# EAGLE design front (EAGLE 6.1)
DOC: PVR-SCH-001; PART_NO: PC-01; PROJECT: PVR; REV: A; TITLE: Front panel interface
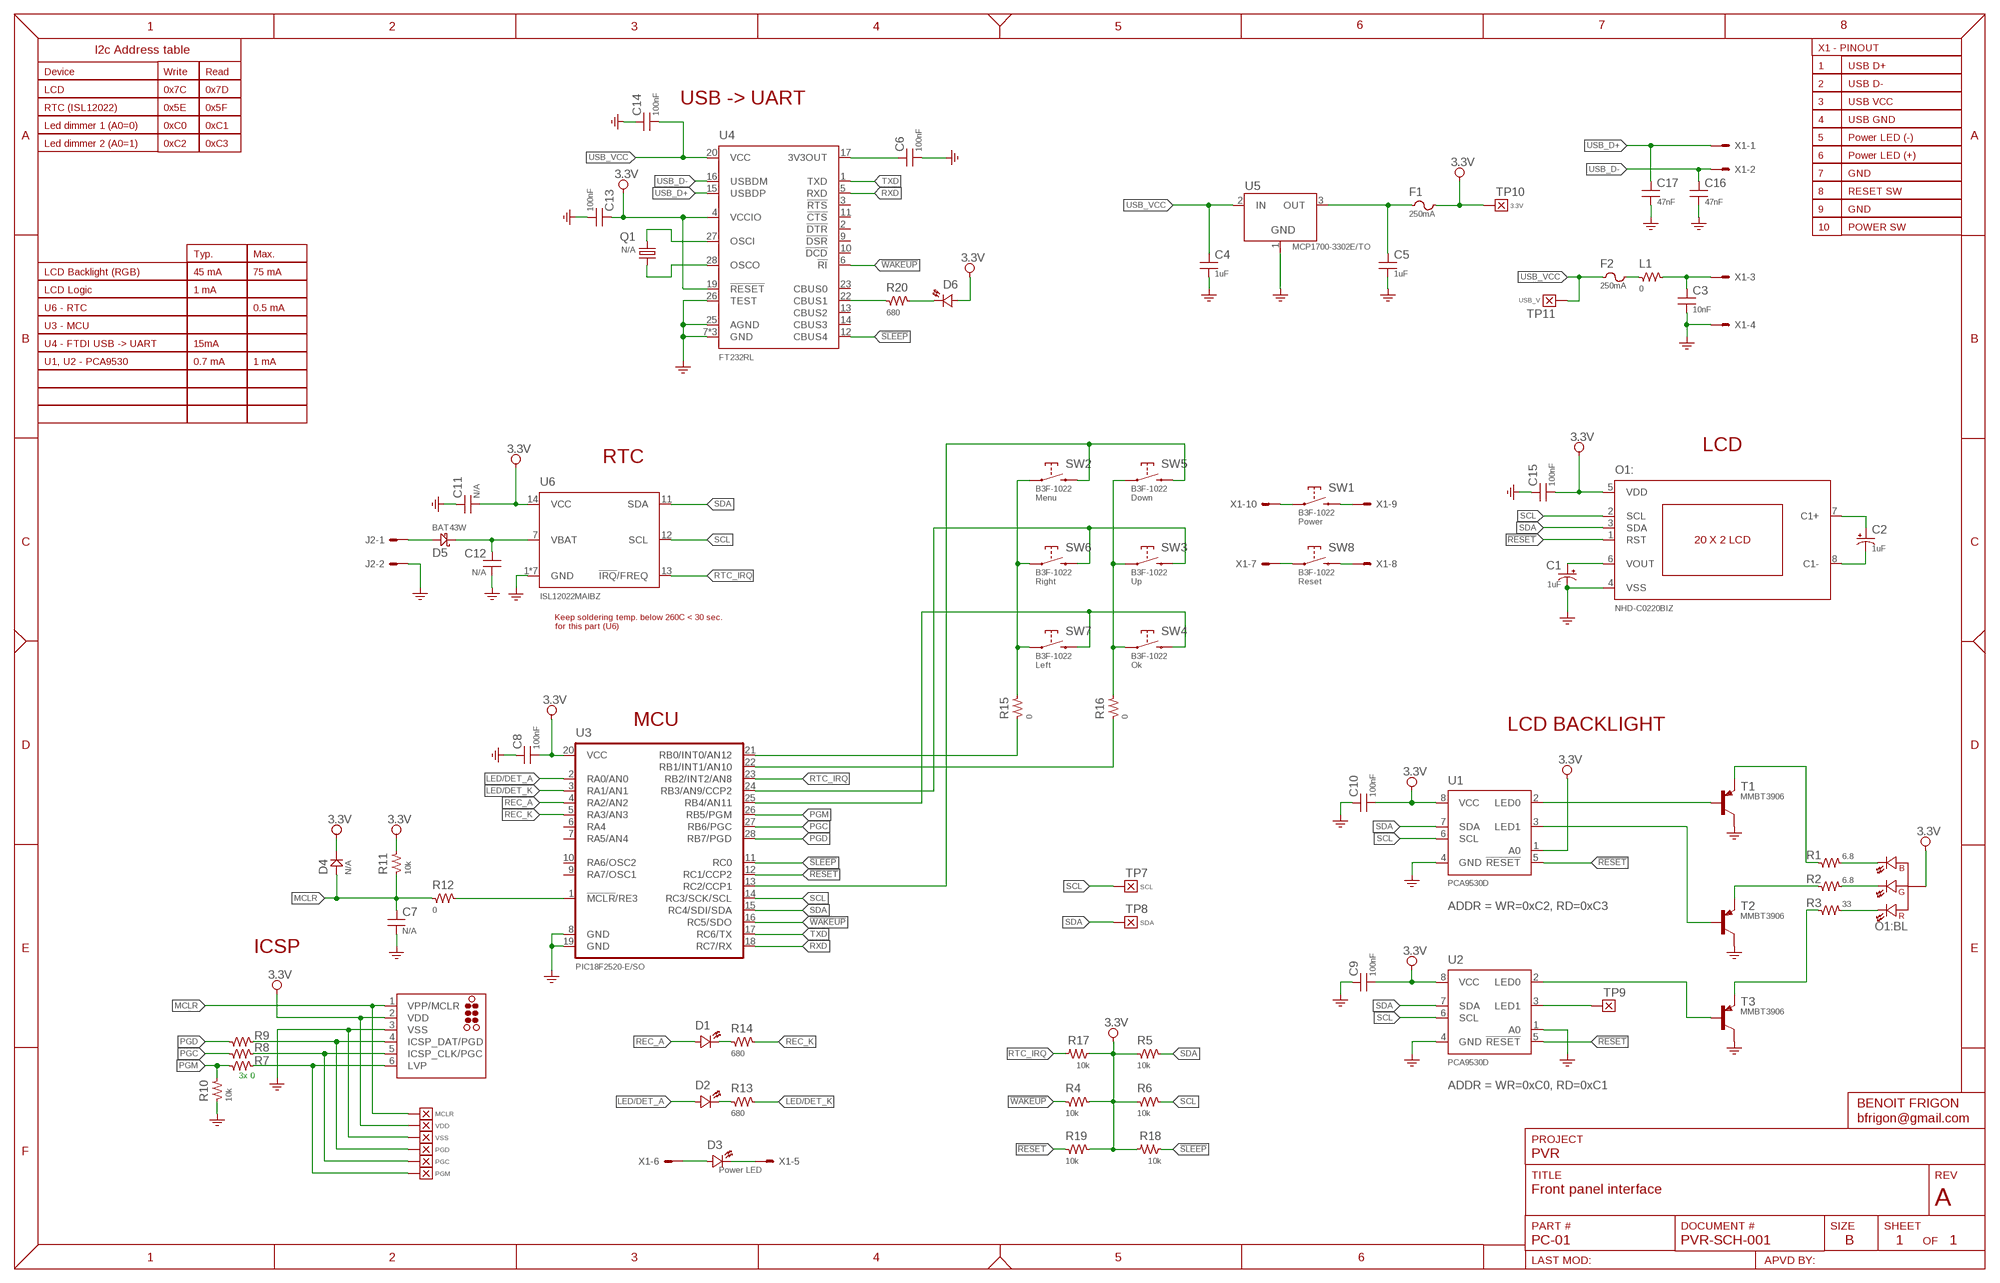
[diagram p0: schematic, sheet 1]

## Parts
C1  1uF  CAP-E-S0805  [CAP_S0805]
C2  1uF  CAP-E-S0805  [CAP_S0805]
C3  10nF  CAP-0805  [SMD_0805]
C4  1uF  CAP-0805  [SMD_0805]
C5  1uF  CAP-0805  [SMD_0805]
C6  100nF  CAP-0603  [SMD_0603]
C7  N/A  CAP-0603  [SMD_0603]
C8  100nF  CAP-0603  [SMD_0603]
C9  100nF  CAP-0603  [SMD_0603]
C10  100nF  CAP-0603  [SMD_0603]
C11  N/A  CAP-0603  [SMD_0603]
C12  N/A  CAP-0805  [SMD_0805]
C13  100nF  CAP-0603  [SMD_0603]
C14  100nF  CAP-0603  [SMD_0603]
C15  100nF  CAP-0603  [SMD_0603]
C16  47nF  CAP-0603  [SMD_0603]
C17  47nF  CAP-0603  [SMD_0603]
D1  {ATTR:COLOR}  LED-2X5  [LED_2X5]
D2  {ATTR:COLOR}  LED-2X5  [LED_2X5]
D3  {ATTR:COLOR}  LED-2X5  [LED_2X5]
D4  N/A  DIODE-0603  [DIODE_0603]
D5  BAT43W  DIODE_SCHOTTKY-SOD323  [SOD-323]
D6  LED-0805  [CHIPLED_0805]
F1  250mA  FUSE1206  [SMD_1206]
F2  250mA  FUSE1206  [SMD_1206]
J1  TC2030-MCP  [TC2030-MCP]
J2  SNG-2MM-HEADER-02-V  [DF3X-2P-2DSA]
L1  0  RES-0805  [SMD_0805]
O1  NHD-C0220BIZ  [NHD-CO220BIZ]
Q1  N/A  XTALMM20SS  [MM20SS]
R1  6.8  RES-1206  [SMD_1206]
R2  6.8  RES-1206  [SMD_1206]
R3  33  RES-1206  [SMD_1206]
R4  10k  RES-0805  [SMD_0805]
R5  10k  RES-0805  [SMD_0805]
R6  10k  RES-0805  [SMD_0805]
R7  0  RES-0603  [SMD_0603]
R8  0  RES-0603  [SMD_0603]
R9  0  RES-0603  [SMD_0603]
R10  10k  RES-0603  [SMD_0603]
R11  10k  RES-0603  [SMD_0603]
R12  0  RES-0603  [SMD_0603]
R13  680  RES-0805  [SMD_0805]
R14  680  RES-0805  [SMD_0805]
R15  0  RES-0805  [SMD_0805]
R16  0  RES-0805  [SMD_0805]
R17  10k  RES-0603  [SMD_0603]
R18  10k  RES-0805  [SMD_0805]
R19  10k  RES-0805  [SMD_0805]
R20  680  RES-0805  [SMD_0805]
SW1  B3F-1022  [B3F-10XX]
SW2  B3F-1022  [B3F-10XX]
SW3  B3F-1022  [B3F-10XX]
SW4  B3F-1022  [B3F-10XX]
SW5  B3F-1022  [B3F-10XX]
SW6  B3F-1022  [B3F-10XX]
SW7  B3F-1022  [B3F-10XX]
SW8  B3F-1022  [B3F-10XX]
T1  MMBT3906  -PNP-SOT23-BEC  [SOT23-BEC]
T2  MMBT3906  -PNP-SOT23-BEC  [SOT23-BEC]
T3  MMBT3906  -PNP-SOT23-BEC  [SOT23-BEC]
TP1  MCLR  TEST_POINT-050  [TP_050]
TP2  VDD  TEST_POINT-050  [TP_050]
TP3  VSS  TEST_POINT-050  [TP_050]
TP4  PGD  TEST_POINT-050  [TP_050]
TP5  PGC  TEST_POINT-050  [TP_050]
TP6  PGM  TEST_POINT-050  [TP_050]
TP7  SCL  TEST_POINT-050  [TP_050]
TP8  SDA  TEST_POINT-050  [TP_050]
TP9  TEST_POINT-050  [TP_050]
TP10  3.3V  TEST_POINT-050  [TP_050]
TP11  USB_V  TEST_POINT-050  [TP_050]
U1  PCA9530D  [SOIC8]
U2  PCA9530D  [SOIC8]
U3  PIC18F2520-E/SO  [SOIC28]
U4  FT232RL  [SSOP28]
U5  MCP1700-3302E/TO  [TO92]
U6  ISL12022MAIBZ  [SOIC20W]
X1  DL-100-HEADER-10-V  [534206-5]

## Nets
3.3V: C8.2 C9.2 C10.2 C11.2 C13.1 C15.2 D4.K D6.A F1.2 J1.2(VDD) O1.5(::VDD) O1.A(:BL:A) R4.2 R5.1 R6.1 R11.2 R17.1 R18.2 R19.2 TP2.1 TP10.1 U1.1(A0) U1.8(VCC) U2.8(VCC) U3.20(VCC) U4.4(VCCIO) U4.19(!RESET) U6.14(VCC)
!RESET: O1.1(::RST) R19.1 U1.5(!RESET) U2.5(!RESET) U3.12(RC1/CCP2)
!SLEEP: R18.1 U3.11(RC0) U4.12(CBUS4)
!WAKEUP: R4.1 U3.16(RC5/SDO) U4.6(!RI)
GND: C1.- C3.2 C4.2 C5.2 C6.2 C7.2 C8.1 C9.1 C10.1 C11.1 C12.2 C13.2 C14.1 C15.1 C16.2 C17.2 J1.3(VSS) J2.2 O1.4(::VSS) R10.1 T1.C T2.C T3.C TP3.1 U1.4(GND) U2.1(A0) U2.4(GND) U3.8(GND) U3.19(GND) U4.7(GND) U4.18(GND) U4.21(GND) U4.25(AGND) U4.26(TEST) U5.1(GND) U6.1(GND) U6.2(GND) U6.3(GND) U6.8(GND) U6.18(GND) U6.19(GND) U6.20(GND) X1.4
LED/DET_A: D2.A U3.2(RA0/AN0)
LED/DET_K: R13.2 U3.3(RA1/AN1)
MCLR: C7.1 D4.A J1.1(VPP/MCLR) R11.1 R12.1 TP1.1
N$4: O1.BK(:BL:BK) R1.2
N$5: O1.GK(:BL:GK) R2.2
N$6: O1.RK(:BL:RK) R3.2
N$7: T1.B U1.2(LED0)
N$8: T2.B U1.3(LED1)
N$9: R1.1 T1.E
N$10: SW1.3 SW1.4 X1.10
N$11: SW1.1 SW1.2 X1.9
N$12: SW8.1 SW8.2 X1.8
N$13: SW8.3 SW8.4 X1.7
N$14: D3.A X1.6
N$15: D3.K X1.5
N$16: C3.1 L1.2 X1.3
N$17: C6.1 U4.17(3V3OUT)
N$18: J1.6(LVP) R7.2 TP6.1
N$19: J1.5(ICSP_CLK/PGC) R8.2 TP5.1
N$20: J1.4(ICSP_DAT/PGD) R9.2 TP4.1
N$21: R15.1 U3.21(RB0/INT0/AN12)
N$22: R16.1 U3.22(RB1/INT1/AN10)
N$23: SW2.1 SW2.2 SW5.1 SW5.2 U3.13(RC2/CCP1)
N$24: SW3.1 SW3.2 SW6.1 SW6.2 U3.24(RB3/AN9/CCP2)
N$25: SW4.1 SW4.2 SW7.1 SW7.2 U3.25(RB4/AN11)
N$26: R12.2 U3.1(!MCLR!/RE3)
N$27: D2.K R13.1
N$28: R15.2 SW2.3 SW2.4 SW6.3 SW6.4 SW7.3 SW7.4
N$29: D1.K R14.1
N$30: R16.2 SW3.3 SW3.4 SW4.3 SW4.4 SW5.3 SW5.4
N$31: C12.1 D5.K U6.7(VBAT)
N$32: R20.1 U4.22(CBUS1)
N$33: D6.K R20.2
N$34: D5.A J2.1
N$35: R2.1 T2.E
N$36: R3.1 T3.E
N$37: C5.1 F1.1 U5.3(OUT)
N$38: T3.B U2.2(LED0)
N$39: F2.2 L1.1
N$40: Q1.1 U4.27(OSCI)
N$41: Q1.4 U4.28(OSCO)
N$42: C2.+ O1.7(::C1+)
N$43: C2.- O1.8(::C1-)
N$44: C1.+ O1.6(::VOUT)
N$45: TP9.1 U2.3(LED1)
PGC: R8.1 U3.27(RB6/PGC)
PGD: R9.1 U3.28(RB7/PGD)
PGM: R7.1 R10.2 U3.26(RB5/PGM)
REC_A: D1.A U3.4(RA2/AN2)
REC_K: R14.2 U3.5(RA3/AN3)
RTC_IRQ: R17.2 U3.23(RB2/INT2/AN8) U6.13(!IRQ!/FREQ)
RXD: U3.18(RC7/RX) U4.5(RXD)
SCL: O1.2(::SCL) R6.2 TP7.1 U1.6(SCL) U2.6(SCL) U3.14(RC3/SCK/SCL) U6.12(SCL)
SDA: O1.3(::SDA) R5.2 TP8.1 U1.7(SDA) U2.7(SDA) U3.15(RC4/SDI/SDA) U6.11(SDA)
TXD: U3.17(RC6/TX) U4.1(TXD)
USB_D+: C17.1 U4.15(USBDP) X1.1
USB_D-: C16.1 U4.16(USBDM) X1.2
USB_VCC: C4.1 C14.2 F2.1 TP11.1 U4.20(VCC) U5.2(IN)
Unconnected: U3.6(RA4) U3.7(RA5/AN4) U3.9(RA7/OSC1) U3.10(RA6/OSC2) U4.2(!DTR) U4.3(!RTS) U4.9(!DSR) U4.10(!DCD) U4.11(!CTS) U4.13(CBUS2) U4.14(CBUS3) U4.23(CBUS0)

## Notes on the sheet
- I2c Address table
- USB -> UART
- LCD
- RTC
- Keep soldering temp. below 260C < 30 sec.
- for this part (U6)
- MCU
- LCD BACKLIGHT
- ICSP
- 3x 0

## Library data of the parts
C1 C2 = Passive:CAP-E: Electrolytic capacitor; DESCRIPTION: {DESCRIPTION} - SMT 0805 - {VALUE}
C3-C5 C12 = Passive:CAP: Capacitor; DESCRIPTION: {DESCRIPTION} - SMT 0805 - {value}; PACKAGE: SMT 0805
C6-C11 C13-C17 = Passive:CAP: Capacitor; DESCRIPTION: {DESCRIPTION} - SMT 0603 - {value}; PACKAGE: SMT 0603
D1 = Optoelectronic:LED: Led; COLOR: Red; DESCRIPTION: {DESCRIPTION} 2x5mm - {ATTR:COLOR}; PACKAGE: 2x5mm; SKU: -
D2 = Optoelectronic:LED: Led; COLOR: Green; DESCRIPTION: {DESCRIPTION} 2x5mm - {ATTR:COLOR}; PACKAGE: 2x5mm; SKU: -
D3 = Optoelectronic:LED: Led; COLOR: Green; DESCRIPTION: {DESCRIPTION} 2x5mm - {ATTR:COLOR}; ID: Power LED; PACKAGE: 2x5mm; SKU: -
D4 = Passive:DIODE: Diode; DESCRIPTION: {DESCRIPTION} - SMT 0603 - {VALUE}; PACKAGE: SMT 0603; SKU: {VALUE}
D5 = Passive:DIODE_SCHOTTKY: Schottky Diode; DESCRIPTION: {DESCRIPTION} - SMT 0603 - {VALUE}; NO_BOM: 1; PACKAGE: SOD-323; SKU: {VALUE}
D6 = Optoelectronic:LED: Led; COLOR: Green; DESCRIPTION: {DESCRIPTION} Chip 0805 - {ATTR:COLOR}; PACKAGE: SMT 0805; SKU: -; VALUE: {ATTR:COLOR}
F1 F2 = Passive:FUSE: Fuse; DESCRIPTION: {DESCRIPTION} - SMT 1206 - {VALUE}
J1 = Connectors:TC2030: TAG-CONNECT ISP Connector Manufacturer: Tag-Connect <www.tag-connect.com> Cable for easy In-Circuit PCB Programming. Designed for Microchip ICD2, suitable for many others. Two variants - one "with legs" (for hads-free fit on PCB) and another "without legs" for quick programming. PAD Description 1 MCLR/Vpp 2 Vdd 3 GND 4 PGD (ISPDAT) 5 PGC (ISPCLK) 6 nc (used for LVP) ©2009 ROFA.cz; MFG: Tag-Connect; NO_BOM: 1
J2 = Connectors:SNG-2MM-HEADER-02: 2mm Single Row Header - 2 pos; DESCRIPTION: {DESCRIPTION} - Vertical; MFG: Hirose Electronic; NO_BOM: 1; SKU: DF3A-2P-2DSA
L1 R4-R6 R13-R16 R18-R20 = Passive:RES: Resistor; DESCRIPTION: {DESCRIPTION} - SMT 0805 - {VALUE}; PACKAGE: SMT 0805
O1 = Optoelectronic:NHD-C0220BIZ: Alphanumeric LCD module 20x2 - RGB Backlight; MFG: Newheaven Display
Q1 = Crystal:XTAL: CRYSTAL
R1-R3 = Passive:RES: Resistor; DESCRIPTION: {DESCRIPTION} - SMT 1206 - {VALUE}; PACKAGE: SMT 1206
R7-R12 R17 = Passive:RES: Resistor; DESCRIPTION: {DESCRIPTION} - SMT 0603 - {VALUE}; PACKAGE: SMT 0603
SW1 = Switch:B3F-?: Tactile switch; DESCRIPTION: {DESCRIPTION} - 6x6mm - 5mm Pitch - 150g; KEY: Power; MFG: Omron Electronics
SW2 = Switch:B3F-?: Tactile switch; DESCRIPTION: {DESCRIPTION} - 6x6mm - 5mm Pitch - 150g; KEY: Menu; MFG: Omron Electronics
SW3 = Switch:B3F-?: Tactile switch; DESCRIPTION: {DESCRIPTION} - 6x6mm - 5mm Pitch - 150g; KEY: Up; MFG: Omron Electronics
SW4 = Switch:B3F-?: Tactile switch; DESCRIPTION: {DESCRIPTION} - 6x6mm - 5mm Pitch - 150g; KEY: Ok; MFG: Omron Electronics
SW5 = Switch:B3F-?: Tactile switch; DESCRIPTION: {DESCRIPTION} - 6x6mm - 5mm Pitch - 150g; KEY: Down; MFG: Omron Electronics
SW6 = Switch:B3F-?: Tactile switch; DESCRIPTION: {DESCRIPTION} - 6x6mm - 5mm Pitch - 150g; KEY: Right; MFG: Omron Electronics
SW7 = Switch:B3F-?: Tactile switch; DESCRIPTION: {DESCRIPTION} - 6x6mm - 5mm Pitch - 150g; KEY: Left; MFG: Omron Electronics
SW8 = Switch:B3F-?: Tactile switch; DESCRIPTION: {DESCRIPTION} - 6x6mm - 5mm Pitch - 150g; KEY: Reset; MFG: Omron Electronics
T1-T3 = Transistor:*-PNP-: PNP Transistor; SKU: {VALUE}
TP1-TP11 = Misc:TEST_POINT; NO_BOM: 1
U1 = IC:PCA9530: 8-bit I2C-bus LED dimmer Features: 2 LED drivers (on, off, flashing at a programmable rate) 2 selectable, fully programmable blink rates (frequency and duty cycle) between 0.591 Hz and 152 Hz (1.69 seconds and 6.58 milliseconds) 256 brightness steps Input/output not used as LED drivers can be used as regular GPIOs Internal oscillator requires no external components I2C-bus interface logic compatible with SMBus Internal power-on reset; ADDR: WR=0xC2, RD=0xC3; MFG: NXP Semiconductors
U2 = IC:PCA9530: 8-bit I2C-bus LED dimmer Features: 2 LED drivers (on, off, flashing at a programmable rate) 2 selectable, fully programmable blink rates (frequency and duty cycle) between 0.591 Hz and 152 Hz (1.69 seconds and 6.58 milliseconds) 256 brightness steps Input/output not used as LED drivers can be used as regular GPIOs Internal oscillator requires no external components I2C-bus interface logic compatible with SMBus Internal power-on reset; ADDR: WR=0xC0, RD=0xC1; MFG: NXP Semiconductors
U3 = IC:PIC18F*520-?: Microcontroller 32k PROG / 1536 RAM / 256 EEPROM
U4 = IC:FT232: USB to serial UART interface
U5 = Power:MCP1700-*?: Low-dropout (LDO) Voltage Regulator; DESCRIPTION: {DESCRIPTION} - 3.3v; MFG: Microchip
U6 = IC:ISL12022MA: Low power RTC with embedded 32.768kHz crystal Features : Embedded 32.768kHz Quartz Crystal in the Package On-chip Oscillator Temperature Compensation; NO_BOM: 1
X1 = Connectors:DL-100-HEADER-10: 10 Pos - Dual Row - 2.54mm; DESCRIPTION: {DESCRIPTION} Receptacle - Vertical; MFG: Sullins Connector Solutions; SKU: SIP110-PPPC-D05-ST-BK

## Board
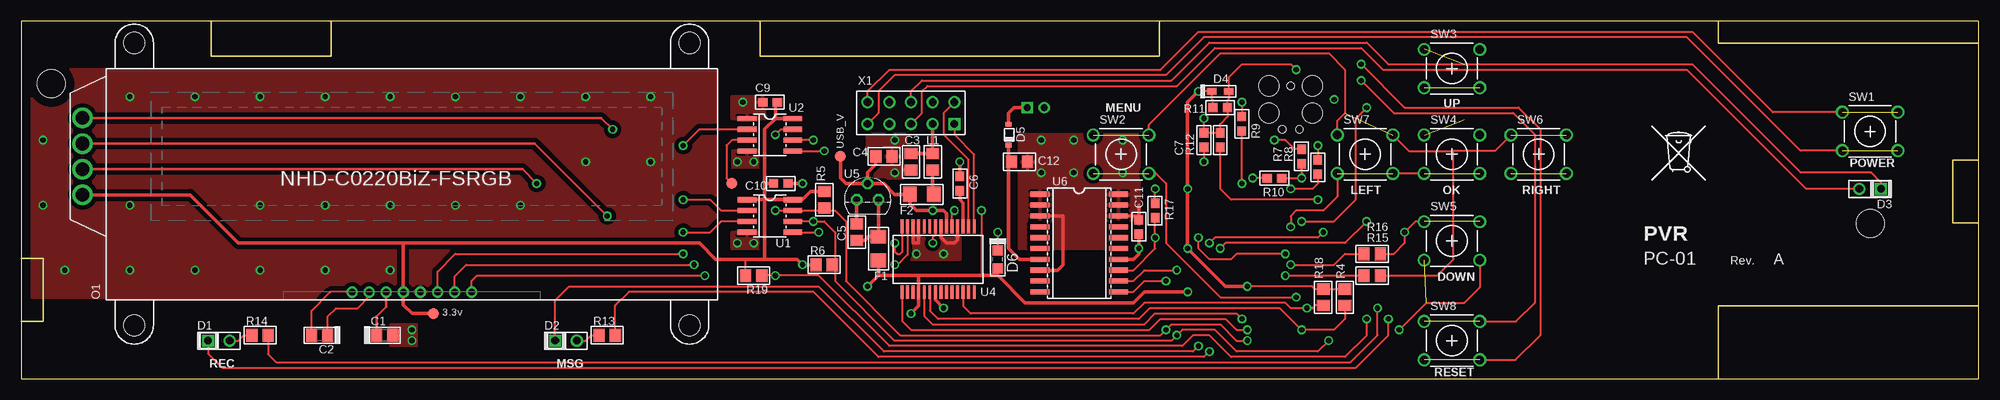
[diagram p1: board, top side]
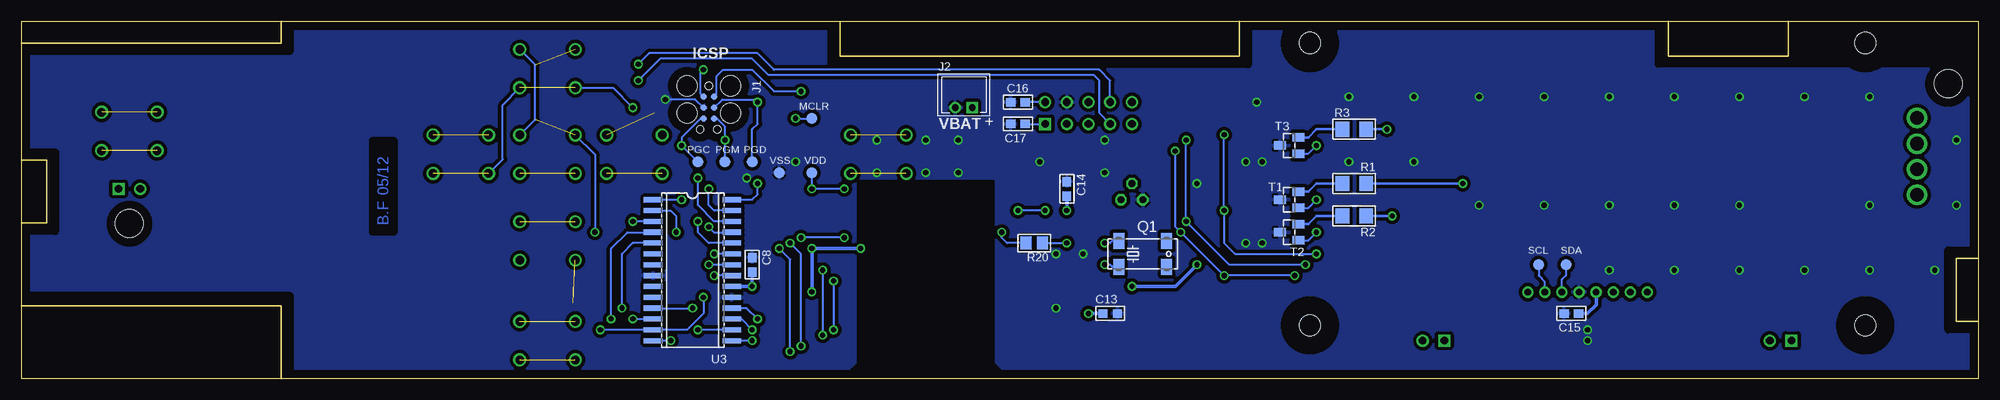
[diagram p2: board, bottom side, seen from below]

Size 229.06 x 41.86 mm. Coordinates in mm from the lower left corner, seen from the top.
Outline: 0,0 229.06,0 229.06,41.86 0,41.86 0,0
Copper layers (1*16): Top 0.035mm / dielectric 1.5mm / Bottom 0.035mm
Design rules: minimum track width 10mil, minimum drill 24mil, track to track 8mil, track to pad 8mil, pad to pad 8mil, via to via 8mil, smd to smd 8mil, copper to edge 40mil, drill to drill 8mil, minimum pad ring 10mil, minimum via ring 8mil, stop-mask expansion 4mil, vias tented up to drill 24mil, thermal gap 10mil
Holes 3.3 mm at 3.51,34.54 216.41,18.16
tKeepout: area 178.6,31.1 to 182.1,34.6; area 178.6,17.9 to 182.1,21.5; area 191.4,16.8 to 195,20.3; area 219.3,16.8 to 222.9,20.3; area 150.6,17.9 to 154.2,21.5; area 141.2,24.3 to 144.8,27.8; area 134.6,5.1 to 151.1,7.6; area 134.6,35.6 to 151.1,38.1
bRestrict: area 185.4,17.1 to 188,27.9; area 0,36.8 to 37.5,41.9; area 85.4,36.8 to 134.3,41.9; area 0,5.7 to 3.6,15.1; area 197.6,0 to 229.1,9.8; area 225,17.2 to 229.1,26.6; area 197.6,38.3 to 229.1,41.9
Milling: 16 lines

### Footprints (pad centres in the part's own frame; a part is rotated, then mirrored left to right if it is on the bottom)
CAP_S0805 = smd 1.3 x 1.5: + -0.95,0; - 0.95,0
SMD_0805 = smd 1.3 x 1.5: 1 -0.95,0; 2 0.95,0
SMD_0603 = smd 1.1 x 1: 1 -0.85,0; 2 0.85,0
LED_2X5 = drill 0.9 square: A -1.27,0 | drill 0.9: K 1.27,0
DIODE_0603 = smd 1.1 x 0.8: A -1,0; K 1,0
SOD-323 = smd 0.559 x 0.686: A -1.219,0; K 1.219,0
CHIPLED_0805 = smd 1.2 x 1.2: A 0,-1.05; K 0,1.05
SMD_1206 = smd 1.6 x 1.8: 1 -1.4,0; 2 1.4,0
TC2030-MCP = smd 0.787 x 0.787: 1 1.27,-0.635; 2 1.27,0.635; 3 2.54,-0.635; 4 2.54,0.635; 5 3.81,-0.635; 6 3.81,0.635 | hole 0.889: 0,0; 5.08,-1.016; 5.08,1.016 | hole 2.375: 0,2.54; 0,-2.54; 3.175,-2.54; 3.175,2.54
DF3X-2P-2DSA = drill 0.8 square: 1 1,0 | drill 0.8: 2 -1,0
NHD-CO220BIZ = drill 0.8: 1 7,-15.9; 2 5,-15.9; 3 3,-15.9; 4 1,-15.9; 5 -1,-15.9; 6 -3,-15.9; 7 -5,-15.9; 8 -7,-15.9 | drill 1.6: A -38.55,-4.5; BK -38.55,-1.5; GK -38.55,1.5; RK -38.55,4.5 | hole 2.5: -32.5,13.3; 32.5,13.3; 32.5,-19.8; -32.5,-19.8
MM20SS = smd 1.27 x 1.88: 1 -2.794,-1.524; 2 2.794,-1.524; 3 2.794,1.524; 4 -2.794,1.524
B3F-10XX = drill 1: 1 3.25,-2.25; 2 -3.25,-2.25; 3 3.25,2.25; 4 -3.25,2.25
SOT23-BEC = smd 1 x 1.4: B -0.95,-1.1; C 0,1.1; E 0.95,-1.1
TP_050 = smd 1.27 x 1.27: 1 0,0
SOIC8 = smd 0.6 x 2.2: 1 -1.905,-2.667; 2 -0.635,-2.667; 3 0.635,-2.667; 4 1.905,-2.667; 5 1.905,2.667; 6 0.635,2.667; 7 -0.635,2.667; 8 -1.905,2.667
SOIC28 = smd 0.6 x 2.2: 1 -8.255,-4.6; 2 -6.985,-4.6; 3 -5.715,-4.6; 4 -4.445,-4.6; 5 -3.175,-4.6; 6 -1.905,-4.6; 7 -0.635,-4.6; 8 0.635,-4.6; 9 1.905,-4.6; 10 3.175,-4.6; 11 4.445,-4.6; 12 5.715,-4.6; 13 6.985,-4.6; 14 8.255,-4.6; 15 8.255,4.6; 16 6.985,4.6; 17 5.715,4.6; 18 4.445,4.6; 19 3.175,4.6; 20 1.905,4.6; 21 0.635,4.6; 22 -0.635,4.6; 23 -1.905,4.6; 24 -3.175,4.6; 25 -4.445,4.6; 26 -5.715,4.6; 27 -6.985,4.6; 28 -8.255,4.6
SSOP28 = smd 0.34 x 1.6: 1 -4.225,-3.85; 2 -3.575,-3.85; 3 -2.925,-3.85; 4 -2.275,-3.85; 5 -1.625,-3.85; 6 -0.975,-3.85; 7 -0.325,-3.85; 8 0.325,-3.85; 9 0.975,-3.85; 10 1.625,-3.85; 11 2.275,-3.85; 12 2.925,-3.85; 13 3.575,-3.85; 14 4.225,-3.85; 15 4.225,3.85; 16 3.575,3.85; 17 2.925,3.85; 18 2.275,3.85; 19 1.625,3.85; 20 0.975,3.85; 21 0.325,3.85; 22 -0.325,3.85; 23 -0.975,3.85; 24 -1.625,3.85; 25 -2.275,3.85; 26 -2.925,3.85; 27 -3.575,3.85; 28 -4.225,3.85
TO92 = drill 0.813 octagon: 1 -1.27,0; 2 0,1.905; 3 1.27,0
SOIC20W = smd 0.6 x 2.2: 1 -5.715,-4.6; 2 -4.445,-4.6; 3 -3.175,-4.6; 4 -1.905,-4.6; 5 -0.635,-4.6; 6 0.635,-4.6; 7 1.905,-4.6; 8 3.175,-4.6; 9 4.445,-4.6; 10 5.715,-4.6; 11 5.715,4.6; 12 4.445,4.6; 13 3.175,4.6; 14 1.905,4.6; 15 0.635,4.6; 16 -0.635,4.6; 17 -1.905,4.6; 18 -3.175,4.6; 19 -4.445,4.6; 20 -5.715,4.6
534206-5 = drill 0.9 square: 1 5.08,-1.27 | drill 0.9: 2 5.08,1.27; 3 2.54,-1.27; 4 2.54,1.27; 5 0,-1.27; 6 0,1.27; 7 -2.54,-1.27; 8 -2.54,1.27; 9 -5.08,-1.27; 10 -5.08,1.27

### Placement (x,y rotation side)
C1  42.55,5.08 0 top
C2  34.92,5.08 180 top
C3  104.14,25.4 270 top
C4  100.97,26.04 0 top
C5  97.79,17.14 90 top
C6  109.86,22.86 90 top
C7  138.43,27.94 270 top
C8  143.51,13.34 270 bottom
C9  87.63,32.38 0 top
C10  88.9,22.86 180 top
C11  130.81,17.78 270 top
C12  116.84,25.4 0 top
C13  101.6,7.62 0 bottom
C14  106.68,22.23 270 bottom
C15  47.62,7.62 0 bottom
C16  112.39,32.38 180 bottom
C17  112.39,29.84 180 bottom
D1  23.11,4.45 0 top
D2  63.75,4.45 0 top
D3  216.41,22.23 180 top
D4  140.34,33.66 180 top
D5  115.57,28.57 270 top
D6  114.3,13.97 0 top
F1  100.33,15.24 270 top
F2  105.41,21.59 0 top
J1  148.59,34.29 270 bottom
J2  118.75,31.75 0 bottom
L1  106.68,25.4 90 top
O1  45.72,26.04 0 top
Q1  97.79,14.61 0 bottom
R1  73.03,22.86 0 bottom
R2  73.03,19.05 0 bottom
R3  73.03,29.21 0 bottom
R4  154.94,9.53 90 top
R5  93.98,20.95 270 top
R6  93.98,13.34 0 top
R7  149.86,26.04 90 top
R8  151.76,24.77 90 top
R9  142.88,29.84 90 top
R10  146.69,23.5 0 top
R11  140.34,31.75 180 top
R12  140.34,27.94 270 top
R13  68.58,5.08 0 top
R14  27.94,5.08 0 top
R15  158.12,12.06 0 top
R16  158.12,14.61 0 top
R17  132.72,19.68 270 top
R18  152.4,9.53 90 top
R19  85.72,12.06 180 top
R20  110.49,15.88 180 bottom
SW1  216.41,28.96 0 top
SW2  128.73,26.29 0 top
SW3  167.46,36.32 0 top
SW4  167.46,26.29 0 top
SW5  167.46,16.13 0 top
SW6  177.62,26.29 0 top
SW7  157.3,26.29 0 top
SW8  167.46,4.45 0 top
T1  80.64,20.95 90 bottom
T2  80.64,17.14 90 bottom
T3  80.64,27.3 90 bottom
TP1  136.53,30.48 0 bottom
TP2  136.53,24.13 0 bottom
TP3  140.34,24.13 0 bottom
TP4  143.51,25.4 0 bottom
TP5  149.86,25.4 0 bottom
TP6  146.69,25.4 0 bottom
TP7  51.44,13.34 0 bottom
TP8  48.26,13.34 0 bottom
TP9  83.19,22.86 0 top
TP10  48.26,7.62 0 top
TP11  95.89,26.04 0 top
U1  87.63,19.05 270 top
U2  87.63,28.57 270 top
U3  150.5,12.7 270 bottom
U4  107.31,13.97 0 top
U5  99.06,20.95 0 top
U6  123.83,15.88 270 top
U$1  [INFO]  201.29,15.88 0 top
U$2  [TRASH_SMALL]  194.31,26.67 0 top
U$6  [LOGO]  186.69,19.05 90 bottom
X1  104.14,31.11 0 top

### Tracks (layer width: path | path; a pad name or v marks a point on that pad's centre or on a via)
3.3V  (via drill 0.61)
  Top 0.254: R19.2 84.78,13.97 | v137.79,33.66 D4.K 139.34,32.75 139.49,32.6 R11.2 | R17.1 v132.72,22.23 | R4.2 R18.2 151.45,10.47 151.13,10.79 v143.51,10.79 | D6.A 114.3,12.06 | U4.19 108.94,19.41 v109.22,19.68 | v112.39,19.68 112.39,12.06
  Top 0.406: 44.72,15.88 O1.5 44.72,8.62 45.72,7.62 TP10.1 | 44.72,15.88 79.38,15.88 81.28,13.97 84.78,13.97 87,13.97 | O1.A 19.74,21.54 25.4,15.88 44.72,15.88 | 87,20.95 U1.8 91.44,20.95 92.39,21.91 R5.1 | 87,13.97 87,20.95 | U1.1 87,20.95 | 105.04,12.06 112.39,12.06 114.3,12.06 117.47,8.89 130.18,8.89 131.44,10.16 v136.53,10.16 | 105.04,12.06 100.33,12.06 | U2.8 88.27,30.48 | C9.2 88.27,32.38 88.27,30.48 | 88.27,30.48 87,29.21 87,22.86 | 87,22.86 87,20.95 | C10.2 87,22.86 | v137.79,33.66 136.53,32.38 v136.53,22.23 v136.53,15.24 140.97,10.79 v143.51,10.79 | 87,13.97 90.81,13.97 v91.44,13.34 R6.1 | v99.06,10.79 100.33,12.06 | F1.2 100.33,12.06 | U6.14 130.18,13.97 130.81,14.61 v130.81,15.24 C11.2 | v104.14,7.62 105.04,8.52 U4.4 105.04,12.06
  Bottom 0.254: J1.2 147.7,33.27 147.7,35.43 146.94,36.2 143.51,36.2 140.97,33.66 v137.79,33.66 | v132.72,22.23 v136.53,22.23 TP2.1 | v109.22,19.68 v112.39,19.68
  Bottom 0.406: v130.81,15.24 v136.53,15.24 v136.53,10.16 | v91.44,13.34 93.98,10.79 v99.06,10.79 | U3.20 v143.51,10.79 C8.2 | C13.1 v104.14,7.62 | C15.2 45.72,7.62 44.72,8.62 O1.5
!RESET  (via drill 0.61)
  Top 0.254: O1.1 52.72,11.45 53.34,12.06 v80.01,12.06 | U2.5 v93.98,26.67 | U1.5 v93.34,17.14 | R19.1 v88.27,12.06 93.34,12.06 101.6,3.81 135.89,3.81 137.16,5.08 139.06,5.08 141.6,2.54 154.94,2.54 157.48,5.08 v157.48,6.99
  Bottom 0.254: v80.01,12.06 v88.27,12.06 v93.34,17.14 93.98,17.78 v93.98,26.67 | v157.48,6.99 U3.12
!SLEEP  (via drill 0.61)
  Top 0.254: R18.1 151.45,8.57 151.13,8.26 v150.5,8.26 148.59,8.26 147.96,8.89 131.44,8.89 130.18,7.62 111.12,7.62 110.24,8.51 U4.12
  Bottom 0.254: U3.11 v150.5,8.26
!WAKEUP  (via drill 0.61)
  Top 0.254: R4.1 154.94,6.99 153.67,5.71 v149.86,5.71 147.32,8.26 132.08,8.26 130.81,6.99 107.31,6.99 106.34,7.96 U4.6
  Bottom 0.254: U3.16 v149.86,5.71
GND  (via drill 0.61)
  Top 0.254: C7.2 v138.43,25.4 | R10.1 v144.15,23.5
  Top 0.406: C6.2 v109.86,25.4 | C10.1 v91.44,22.86 | C5.2 U5.1 | U6.8 121.28,12.7 121.92,13.34 121.92,19.05 U6.3 | 128.27,19.05 130.81,19.05 130.81,20.32 | U4.7 106.99,9.21 v107.95,8.26 | U4.26 104.39,15.88 105.04,15.88 U4.25 | U4.21 107.64,16.51 108.28,15.88 109.22,15.88 109.59,16.25 U4.18
  Bottom 0.254: J1.3 150.18,32.7 v153.67,32.7
  other vias: 102.23,27.94 102.23,24.13 104.78,14.61 107.95,14.61 83.82,25.4 83.82,15.88 84.45,32.38 85.72,15.88 85.72,25.4 45.72,4.45 45.72,5.71 119.38,24.13 119.38,27.94 123.19,27.94 123.19,24.13 128.91,24.13 128.91,27.94 5.08,12.7 2.54,27.94 2.54,20.32 12.7,33.02 12.7,12.7 12.7,20.32 20.32,12.7 58.42,20.32 43.18,12.7 27.94,12.7 27.94,20.32 35.56,12.7 35.56,33.02 27.94,33.02 20.32,33.02 35.56,20.32 43.18,20.32 50.8,20.32 43.18,33.02 50.8,33.02 58.42,33.02 66.04,33.02 73.66,33.02 66.04,25.4 73.66,25.4
  pour Bottom (isolate 0.406): 0,0 0,41.86 229.06,41.86 229.06,0 133.35,0 131.44,1.91 131.44,23.5 114.94,23.5 114.94,1.91 113.03,0
  pour Top (isolate 0.406): 103.5,23.5 103.5,28.57 99.06,28.57 99.06,23.5
  pour Top: 87,30.48 83.19,30.48 83.19,33.02 87,33.02
  pour Top (isolate 0.406): 86.36,15.24 83.19,15.24 83.19,17.14 86.36,17.14
  pour Top (isolate 0.406): 87,24.77 83.19,24.77 83.19,26.67 87,26.67
  pour Top: 43.18,3.81 46.35,3.81 46.35,6.35 43.18,6.35
  pour Top (isolate 0.406): 104.14,16.51 104.14,13.97 109.86,13.97 109.86,16.51
  pour Top (isolate 0.406): 130.81,15.24 130.81,28.57 116.84,28.57 116.84,15.24
  pour Top (isolate 0.508): 1.27,9.53 1.27,36.2 81.28,36.2 81.28,9.53
LED/DET_A  (via drill 0.61)
  Top 0.254: v137.79,3.81 137.16,3.17 100.97,3.17 93.34,10.79 64.14,10.79 62.48,9.14 D2.A | v152.4,17.14 151.76,16.51 139.7,16.51 v139.06,15.88
  Bottom 0.254: v139.06,15.88 137.79,14.61 v137.79,3.81 | U3.2 153.03,19.68 152.4,19.05 v152.4,17.14
LED/DET_K  (via drill 0.61)
  Top 0.254: v139.06,3.17 138.43,2.54 100.33,2.54 92.71,10.16 71.12,10.16 69.53,8.57 R13.2 | v157.48,18.41 154.94,15.88 140.97,15.88 v140.34,15.24
  Bottom 0.254: v140.34,15.24 139.06,13.97 v139.06,3.17 | U3.3 v157.48,18.41
MCLR  (via drill 0.61)
  Top 0.254: v149.22,36.2 148.59,36.83 142.88,36.83 141.34,35.29 D4.A 141.34,32.75 141.19,32.6 R11.1 141.19,30.7 140.34,29.84 R12.1 C7.1 v138.43,30.48
  Bottom 0.254: J1.1 149.54,33.34 149.54,35.88 v149.22,36.2 | v138.43,30.48 TP1.1
N$4  (via drill 0.61)
  Top 0.305: O1.BK 58.65,24.54 v60.33,22.86
  Bottom 0.305: v60.33,22.86 R1.2
N$5  (via drill 0.61)
  Top 0.305: v68.58,19.05 60.09,27.54 O1.GK
  Bottom 0.305: R2.2 v68.58,19.05
N$6  (via drill 0.61)
  Top 0.305: O1.RK 67.89,30.54 v69.22,29.21
  Bottom 0.305: R3.2 v69.22,29.21
N$7  (via drill 0.61)
  Top 0.254: v77.47,20.95 80.64,20.95 81.92,19.68 U1.2
  Bottom 0.254: T1.B 78.42,20 v77.47,20.95
N$8  (via drill 0.61)
  Top 0.254: v77.47,17.14 80.64,17.14 81.92,18.41 U1.3
  Bottom 0.254: T2.B 78.42,16.2 v77.47,17.14
N$9
  Bottom 0.305: R1.1 77.47,22.86 78.42,21.91 T1.E
N$10  (1 unrouted)
  Top 0.254: X1.10 99.06,33.66 101.6,36.2 133.35,36.2 137.79,40.64 195.58,40.64 205.01,31.21 SW1.4
N$11  (1 unrouted)
  Top 0.254: X1.9 100.33,31.11 100.33,33.66 102.23,35.56 133.99,35.56 138.43,40.01 194.94,40.01 207.65,27.3 207.99,26.96 208.24,26.71 SW1.2
N$12  (via drill 0.61)  (1 unrouted)
  Top 0.254: v156.84,36.83 161.93,31.75 175.26,31.75 177.8,29.21 177.8,5.08 174.91,2.19 SW8.1
  Bottom 0.254: X1.8 101.6,34.92 102.87,36.2 140.97,36.2 142.88,38.1 155.57,38.1 v156.84,36.83
N$13  (via drill 0.61)  (1 unrouted)
  Top 0.254: v156.84,34.92 160.66,31.11 174.62,31.11 177.16,28.57 177.16,8.89 174.97,6.7 SW8.3
  Bottom 0.254: X1.7 102.87,31.11 102.87,34.92 103.5,35.56 141.6,35.56 143.51,37.47 154.31,37.47 v156.84,34.92
N$14
  Top 0.254: X1.6 104.14,33.66 105.41,34.92 134.62,34.92 139.06,39.37 157.48,39.37 160.02,36.83 195.58,36.83 208.28,24.13 216.53,24.13 217.68,22.99 D3.A
N$15
  Top 0.254: X1.5 105.41,31.11 105.41,33.66 106.05,34.29 135.25,34.29 139.7,38.73 156.84,38.73 159.38,36.2 194.94,36.2 208.91,22.23 D3.K
N$16
  Top 0.406: X1.3 L1.2 C3.1
N$17
  Top 0.406: C6.1 109.86,20.95 110.24,20.57 U4.17
N$18  (via drill 0.61)
  Top 0.254: R7.2 149.01,26.89 147.96,27.94 v146.69,27.94
  Bottom 0.254: J1.6 147.64,30.48 146.69,29.53 v146.69,27.94 TP6.1
N$19  (via drill 0.61)
  Top 0.254: v151.76,27.3 R8.2
  Bottom 0.254: J1.5 149.54,30.48 151.76,28.26 v151.76,27.3 TP5.1
N$20  (via drill 0.61)
  Top 0.254: v142.88,32.38 R9.2
  Bottom 0.254: J1.4 147,32.7 143.19,32.7 v142.88,32.38 142.88,29.84 143.51,29.21 TP4.1
N$21  (via drill 0.61)
  Top 0.254: v147.96,12.06 R15.1
  Bottom 0.254: U3.21 v147.96,12.06
N$22  (via drill 0.61)
  Top 0.254: v148.59,13.34 153.67,13.34 154.94,14.61 R16.1
  Bottom 0.254: U3.22 v148.59,13.34
N$23  (via drill 0.61)  (2 unrouted)
  Top 0.254: v149.22,9.53 140.34,9.53 133.99,15.88 133.99,22.86 132.81,24.04 SW2.1 | v161.29,5.71 164.47,8.89 168.91,8.89 170.71,10.69 SW5.1
  Bottom 0.254: v149.22,9.53 149.22,7.62 151.13,5.71 U3.13 v161.29,5.71
N$24  (via drill 0.61)  (2 unrouted)
  Top 0.254: v157.48,31.75 156.21,30.48 156.21,20.95 153.67,18.41 v149.86,18.41
  Bottom 0.254: U3.24 148.59,15.88 149.86,17.14 v149.86,18.41 | SW6.2 172.72,25.69 172.72,32.06 SW3.1 | SW3.2 159.8,34.07 v157.48,31.75
N$25  (via drill 0.61)  (2 unrouted)
  Top 0.254: SW4.2 SW7.1 | SW7.2 154.05,21.34 152.4,19.68 149.22,19.68 148.59,19.05 v148.59,17.78
  Bottom 0.254: v148.59,17.78 147.96,17.14 U3.25
N$26  (via drill 0.61)
  Top 0.254: R12.2 140.34,22.23 141.6,20.95 v151.76,20.95
  Bottom 0.254: U3.1 v151.76,20.95
N$27
  Top 0.254: D2.K 66.04,4.45 66.67,5.08 R13.1
N$28  (3 unrouted)
  Top 0.254: SW2.3 131.98,29.74 140.34,38.1 153.03,38.1 154.94,36.2 154.94,31.11 154.05,30.23 SW7.4 | 167.64,26.67 167.64,13.97 165.74,12.06 R15.2 | SW6.4 172.5,26.67 167.64,26.67 | SW7.3 162.42,26.67 167.64,26.67
N$29
  Top 0.254: D1.K 25.4,4.45 26.04,5.08 R14.1
N$30  (via drill 0.61)  (3 unrouted)
  Top 0.254: R16.2 160.66,14.61 161.93,15.88 v161.93,17.14 163.16,18.38 SW5.4
  Bottom 0.254: SW3.3 168.91,36.77 168.91,30.34 SW4.3 | SW4.4 161.93,26.25 v161.93,17.14
N$31
  Top 0.406: D5.K 115.57,25.4 | 115.57,25.4 115.57,15.24 116.84,13.97 U6.7 | C12.1 115.57,25.4
N$32  (via drill 0.61)
  Top 0.254: U4.22 106.99,16.82 106.68,16.51 v106.68,15.88
  Bottom 0.254: R20.1 v106.68,15.88
N$33  (via drill 0.61)
  Top 0.254: D6.K v114.3,17.14
  Bottom 0.254: R20.2 113.67,15.88 114.3,16.51 v114.3,17.14
N$34
  Top 0.406: D5.A 115.57,31.11 116.2,31.75 J2.1
N$35
  Bottom 0.305: T2.E 78.42,18.09 77.47,19.05 R2.1
N$36
  Bottom 0.305: T3.E 78.42,28.25 77.47,29.21 R3.1
N$37
  Top 0.406: U5.3 F1.1 99.19,16.64 98.75,16.2 C5.1
N$38  (via drill 0.61)
  Top 0.254: v77.47,27.3 79.38,29.21 U2.2
  Bottom 0.254: T3.B 78.42,26.36 v77.47,27.3
N$39
  Top 0.406: L1.1 106.68,21.59 F2.2
N$40  (via drill 0.61)
  Top 0.254: U4.27 103.74,14.52 102.55,13.34 v102.23,13.34
  Bottom 0.254: Q1.1 101.35,13.08 101.6,13.34 v102.23,13.34
N$41  (via drill 0.61)
  Top 0.254: U4.28 103.09,14.82 102.87,14.61 102.55,14.61 102.23,14.92 v102.23,15.88
  Bottom 0.254: Q1.4 101.35,16.13 101.6,15.88 v102.23,15.88
N$42
  Top 0.254: C2.+ 35.88,7.3 36.83,8.26 39.37,8.26 40.72,9.61 O1.7
N$43
  Top 0.254: O1.8 36.17,10.13 33.98,7.94 C2.-
N$44
  Top 0.305: O1.6 42.72,8.43 41.59,7.3 C1.+
N$45
  Top 0.254: U2.3 83.19,27.94 82.55,27.3 82.55,23.5 TP9.1
PGC  (via drill 0.61)
  Top 0.254: R8.1 151.76,22.86 151.13,22.23 v148.59,22.23
  Bottom 0.254: U3.27 147.96,19.68 148.59,20.32 v148.59,22.23
PGD  (via drill 0.61)
  Top 0.254: v142.88,22.86 R9.1
  Bottom 0.254: U3.28 143.51,20.95 142.88,21.59 v142.88,22.86
PGM  (via drill 0.61)
  Top 0.254: R10.2 v149.86,23.5 R7.1
  Bottom 0.254: U3.26 147.96,18.41 149.86,20.32 v149.86,23.5
REC_A  (via drill 0.61)
  Top 0.254: v160.02,6.99 160.02,5.08 156.21,1.27 23.5,1.27 21.84,2.92 D1.A
  Bottom 0.254: v160.02,6.99 160.02,15.24 158.12,17.14 U3.4
REC_K  (via drill 0.61)
  Top 0.254: R14.2 28.89,2.86 29.84,1.91 155.57,1.91 158.75,5.08 v158.75,8.26
  Bottom 0.254: v158.75,8.26 158.75,14.61 157.48,15.88 U3.5
RTC_IRQ  (via drill 0.61)
  Top 0.254: U6.13 130.18,12.7 132.72,15.24 v132.72,16.51 R17.2 | v147.96,14.61 142.24,14.61 141.6,13.97 139.06,13.97 137.79,15.24 v137.79,16.51
  Bottom 0.254: v132.72,16.51 v137.79,16.51 | U3.23 v147.96,14.61
RXD  (via drill 0.61)
  Top 0.254: v142.88,6.99 142.24,7.62 132.72,7.62 131.44,6.35 106.68,6.35 105.69,7.34 U4.5
  Bottom 0.254: v142.88,6.99 144.15,8.26 U3.18
SCL  (via drill 0.61)
  Top 0.254: O1.2 50.72,11.98 52.07,13.34 v78.74,13.34 | U1.6 v92.71,18.41 93.98,18.41 95.25,17.14 95.25,13.34 | v92.71,27.94 U2.6 | R6.2 95.25,13.34 | 95.25,13.34 95.25,11.43 102.23,4.45 134.62,4.45 v135.25,5.08 135.89,5.71 139.7,5.71 142.24,3.17 151.76,3.17 v153.03,4.45 | U6.12 130.18,11.43 131.44,12.7 v135.25,12.7
  Bottom 0.254: v78.74,13.34 87.63,13.34 v92.71,18.41 v92.71,27.94 | v135.25,12.7 v135.25,5.08 | v153.03,4.45 U3.14 | TP7.1 51.44,12.06 50.72,11.35 O1.2
SDA  (via drill 0.61)
  Top 0.254: O1.3 48.72,12.53 50.8,14.61 v77.47,14.61 | U1.7 v88.27,19.68 93.98,19.68 | v88.27,28.57 88.9,29.21 U2.7 | 93.98,19.68 95.25,19.68 96.52,18.41 96.52,11.43 102.87,5.08 133.35,5.08 v133.99,5.71 134.62,6.35 140.34,6.35 142.24,4.45 v143.51,4.45 | R5.2 93.98,19.68 | U6.11 130.18,10.16 131.44,11.43 v133.99,11.43
  Bottom 0.254: v77.47,14.61 87,14.61 88.27,15.88 v88.27,19.68 v88.27,28.57 | v143.51,4.45 U3.15 | v133.99,11.43 v133.99,5.71 | TP8.1 48.26,12.06 48.72,11.61 O1.3
TXD  (via drill 0.61)
  Top 0.254: v143.51,5.71 142.24,5.71 140.97,6.99 133.35,6.99 132.08,5.71 104.14,5.71 103.09,6.76 U4.1
  Bottom 0.254: v143.51,5.71 144.78,6.99 U3.17
USB_D+
  Top 0.254: X1.1 109.22,28.57 111.54,26.25 U4.15
  Bottom 0.254: C17.1 X1.1
USB_D-
  Top 0.254: X1.2 107.95,31.11 107.95,28.57 110.89,25.64 U4.16
  Bottom 0.254: X1.2 C16.1
USB_VCC  (via drill 0.61)
  Top 0.406: U5.2 100.97,22.86 102.23,21.59 F2.1 104.01,20.45 104.78,19.68 v106.68,19.68 107.95,19.68 108.29,19.34 U4.20 | U5.2 99.06,24.13 100.02,25.09 C4.1 | U5.2 96.52,22.86 95.89,23.5 TP11.1
  Bottom 0.406: v106.68,19.68 C14.2

### Text on the board
bPlace: ICSP | + | VBAT
tNames: UP | MENU | USB_V | POWER | NHD-C0220BiZ-FSRGB | LEFT | OK | RIGHT | DOWN | 3.3v | REC | MSG | RESET
bNames: MCLR | PGD | PGM | PGC | VDD | VSS | SDA | SCL
_tsilk: SW3 | D4 | C9 | X1 | SW1 | R11 | UP | U2 | MENU | SW2 | SW7 | SW4 | SW6 | D5 | R9 | USB_V | C4 | C3 | L1 | C7 | R12 | C12 | R7 | R8 | POWER | NHD-C0220BiZ-FSRGB | C10 | R5 | U5 | U6 | C6 | C11 | R10 | LEFT | OK | RIGHT | R17 | D3 | SW5 | F2 | R16 | C5 | R15 | PVR | U1 | R6 | F1 | PC-01 | Rev. | A | D6 | R18 | R4 | R19 | U4 | DOWN | O1 | SW8 | 3.3v | D1 | R14 | C1 | D2 | R13 | C2 | REC | MSG | RESET
_bsilk: ICSP | J2 | C16 | J1 | R3 | MCLR | T3 | C17 | + | VBAT | PGD | PGM | PGC | VDD | VSS | R1 | C14 | T1 | R2 | Q1 | SDA | SCL | T2 | R20 | C8 | C13 | C15 | U3